# Altium schematic sheet microcontroller.SchDoc
size A4
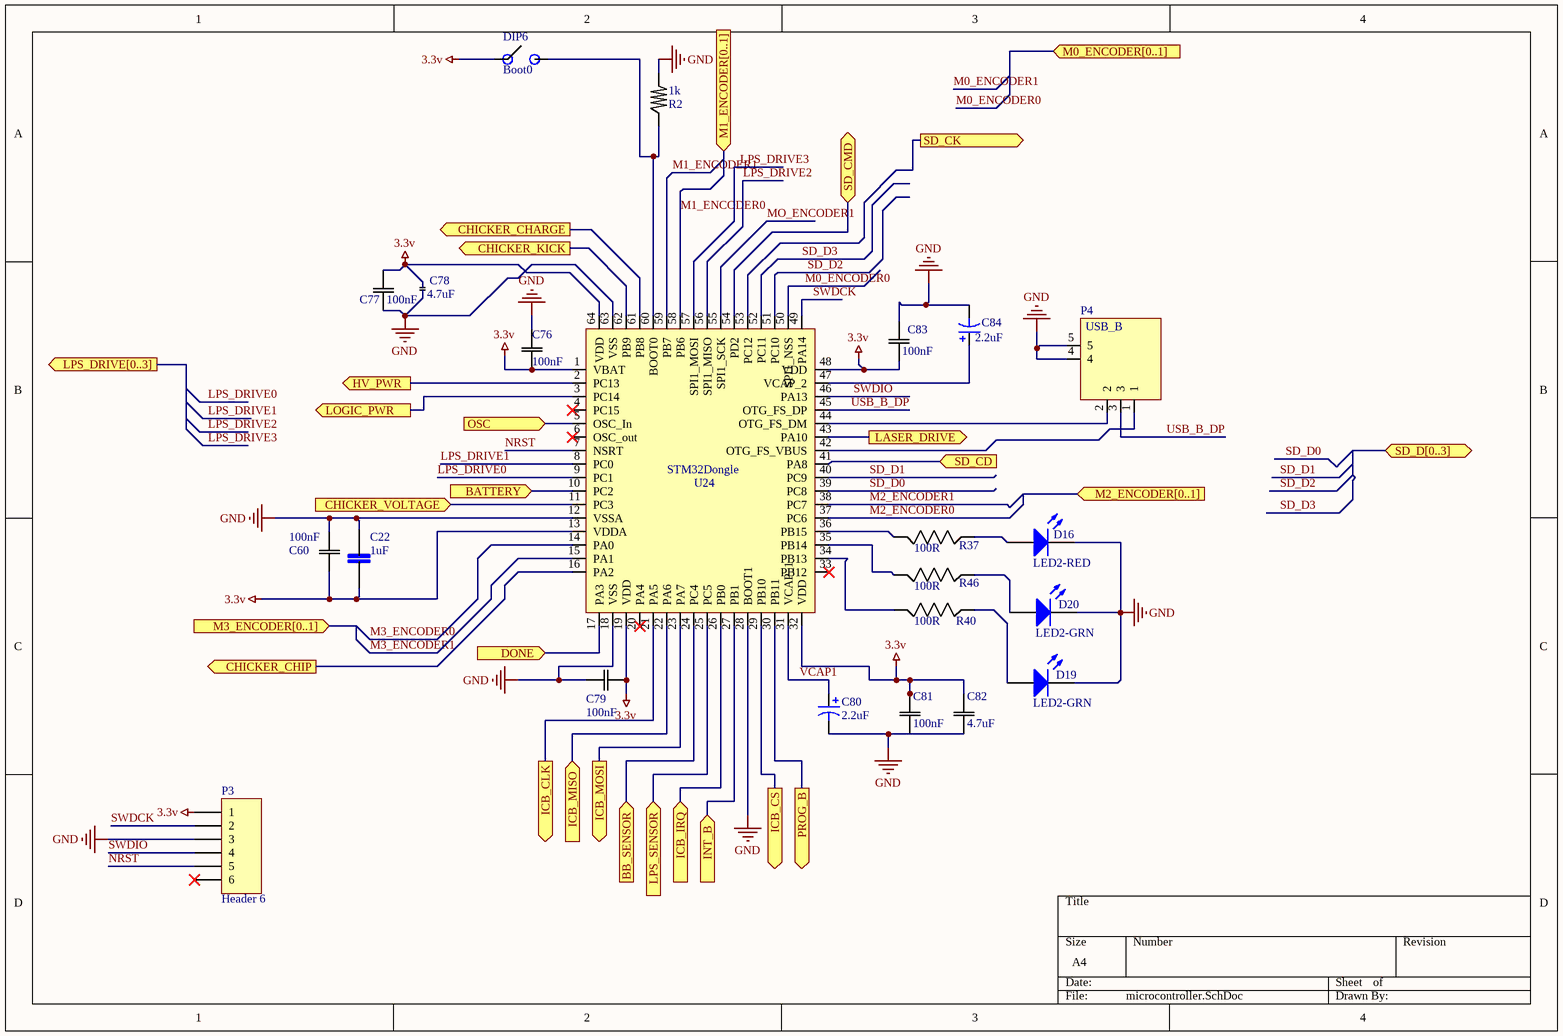
[diagram p0: microcontroller.SchDoc]

## Parts
1k  R2  [CAPC2012X140N]
C22  1uF  [INDC2012X87N]
C60  100nF  [CAPC2013X110N]
C76  100nF  [CAPC2013X110N]
C77  100nF  [CAPC2013X110N]
C78  4.7uF  [0805]
C79  100nF  [CAPC2013X110N]
C80  2.2uF  [C0805]
C81  100nF  [CAPC2013X110N]
C82  4.7uF  [CAPC2013X110N]
C83  100nF  [CAPC2013X110N]
C84  2.2uF  [C0805]
D16  LED2-RED  [3.2X1.6X1.1]
D19  LED2-GRN  [3.2X1.6X1.1]
D20  LED2-GRN  [3.2X1.6X1.1]
DIP6  Boot0  [SOJ254P980X912-12M]
P3  Header 6  [HDR1X6]
P4  USB_B  [PCBComponent_1]
R37  100R  [RESC2012X60]
R40  100R  [RESC2012X60]
R46  100R  [RESC2012X60]
STM32Dongle  U24  [QFP50P1200X1200X160-64N]

## Ports
BATTERY (in), BB_SENSOR (in), CHICKER_CHARGE (out), CHICKER_CHIP (out), CHICKER_KICK (out), CHICKER_VOLTAGE (in), DONE (in), HV_PWR (out), ICB_CLK (out), ICB_CS (out), ICB_IRQ (in), ICB_MISO (in), ICB_MOSI (out), INT_B (in), LASER_DRIVE (out), LOGIC_PWR (out), LPS_DRIVE[0..3] (out), LPS_SENSOR (in), M0_ENCODER[0..1] (in), M1_ENCODER[0..1] (in), M2_ENCODER[0..1] (in), M3_ENCODER[0..1] (in), OSC (in), PROG_B (out), SD_CD (in), SD_CK (out), SD_CMD (bidir), SD_D[0..3] (bidir)

## Nets
3.3v: C22.1 C60.1(C1) C76.1(C1) C77.2(C2) C78.P1 C79.2(C2) C81.2(C2) C82.2(C2) C83.1(C1) DIP6.12 P3.1 STM32Dongle.1(VBAT) STM32Dongle.13(VDDA) STM32Dongle.19(VDD) STM32Dongle.32(VDD) STM32Dongle.48(VDD) STM32Dongle.64(VDD)
GND: 1k.2 C22.2 C60.2(C2) C76.2(C2) C77.1(C1) C78.P2 C79.1(C1) C80.2 C81.1(C1) C82.1(C1) C83.2(C2) C84.2 D16.2(K) D19.2(K) D20.2(K) P3.3 P4.4 P4.5 STM32Dongle.12(VSSA) STM32Dongle.18(VSS) STM32Dongle.28(BOOT1) STM32Dongle.63(VSS)
BATTERY: STM32Dongle.10(PC2) ; port BATTERY
BB_SENSOR: STM32Dongle.24(PC4) ; port BB_SENSOR
CHICKER_CHARGE: STM32Dongle.61(PB8) ; port CHICKER_CHARGE
CHICKER_CHIP: STM32Dongle.16(PA2) ; port CHICKER_CHIP
CHICKER_KICK: STM32Dongle.62(PB9) ; port CHICKER_KICK
CHICKER_VOLTAGE: STM32Dongle.11(PC3) ; port CHICKER_VOLTAGE
DONE: STM32Dongle.17(PA3) ; port DONE
HV_PWR: STM32Dongle.2(PC13) ; port HV_PWR
ICB_CLK: STM32Dongle.21(PA5) ; port ICB_CLK
ICB_CS: STM32Dongle.29(PB10) ; port ICB_CS
ICB_IRQ: STM32Dongle.26(PB0) ; port ICB_IRQ
ICB_MISO: STM32Dongle.22(PA6) ; port ICB_MISO
ICB_MOSI: STM32Dongle.23(PA7) ; port ICB_MOSI
INT_B: STM32Dongle.27(PB1) ; port INT_B
LASER_DRIVE: STM32Dongle.43(PA10) ; port LASER_DRIVE
LOGIC_PWR: STM32Dongle.3(PC14) ; port LOGIC_PWR
LPS_DRIVE0: STM32Dongle.9(PC1)
LPS_DRIVE1: STM32Dongle.8(PC0)
LPS_DRIVE2: STM32Dongle.56(SPI1_MISO)
LPS_DRIVE3: STM32Dongle.57(SPI1_MOSI)
LPS_SENSOR: STM32Dongle.25(PC5) ; port LPS_SENSOR
M0_ENCODER0: STM32Dongle.50(SPI1_NSS)
M1_ENCODER0: STM32Dongle.58(PB6)
M1_ENCODER1: STM32Dongle.59(PB7)
M2_ENCODER0: STM32Dongle.37(PC6)
M2_ENCODER1: STM32Dongle.38(PC7)
M3_ENCODER0: STM32Dongle.14(PA0)
M3_ENCODER1: STM32Dongle.15(PA1)
MO_ENCODER1: STM32Dongle.55(SPI1_SCK)
NRST: P3.5 STM32Dongle.7(NSRT)
OSC: STM32Dongle.5(OSC_In) ; port OSC
PROG_B: STM32Dongle.30(PB11) ; port PROG_B
SD_CD: STM32Dongle.41(PA8) ; port SD_CD
SD_CK: STM32Dongle.53(PC12) ; port SD_CK
SD_CMD: STM32Dongle.54(PD2) ; port SD_CMD
SD_D0: STM32Dongle.39(PC8)
SD_D1: STM32Dongle.40(PC9)
SD_D2: STM32Dongle.51(PC10)
SD_D3: STM32Dongle.52(PC11)
SWDCK: P3.2 STM32Dongle.49(PA14)
SWDIO: P3.4 STM32Dongle.46(PA13)
USB_B_DP: P4.3 STM32Dongle.45(OTG_FS_DP)
VCAP1: C80.1 STM32Dongle.31(VCAP_1)
Net1k_1: 1k.1 DIP6.1 STM32Dongle.60(BOOT0)
NetC84_1: C84.1 STM32Dongle.47(VCAP_2)
NetD16_1: D16.1(A) R37.2
NetD19_1: D19.1(A) R40.2
NetD20_1: D20.1(A) R46.2
NetP4_1: P4.1 STM32Dongle.42(OTG_FS_VBUS)
NetP4_2: P4.2 STM32Dongle.44(OTG_FS_DM)
NetR37_1: R37.1 STM32Dongle.36(PB15)
NetR40_1: R40.1 STM32Dongle.34(PB13)
NetR46_1: R46.1 STM32Dongle.35(PB14)

Not connected (* = marked no-connect by the designer): P3 6*; STM32Dongle 4(PC15)* 6(OSC_out)* 20(PA4)* 33(PB12)*

## Library data of the parts
1k = 1kohm: 1276-5272-1-ND
C22 = C2012X5R1E105M085AC: CAP CER 1UF 25V X5R 0805; MF: TDK; Package: 0805 TDK; MP: C2012X5R1E105M085AC; Value: *
C60 C76 C77 = C0805C104K5RACTU: Capacitor; Ceramic; Cap; .100UF ; Tol+-10%; SMD; Vol-Rtg 50V; X7R, Tape/Reel; MF: Kemet; Package: 0805 Kemet; MP: C0805C104K5RACTU; Value: *
C79 C81 = C0805C104K5RACTU: Capacitor; Ceramic; Cap; .100UF ; Tol+-10%; SMD; Vol-Rtg 50V; X7R, Tape/Reel; Value: 0.1uF; MF: KEMET; DP: 399-1170-1-ND; Tolerance: 10%; MP: C0805C104K5RACTU; Distributor: Digikey; DL: https://www.digikey.ca/; Datasheet Link: https://content.kemet.com/datasheets/KEM_C1002_X7R_SMD.pdf; Part Number: 399-1170-1-ND; Package: 0805 (2012 Metric); Rating: 50V
C80 = Cap Pol3: CAP CER 2.2UF 25V X7R 0805; MF: Samsung Electro-Mechanics; MP: CL21B225KAFNNWE; DP: 1276-2955-1-ND; Tolerance: 10%; Distributor: Digikey; DL: https://www.digikey.ca/; Value: 2.2uF; Rating: 25V; Datasheet Link: http://www.samsungsem.com/kr/support/product-search/mlcc/__icsFiles/afieldfile/2018/07/24/CL21B225KAFNNWE.pdf; Package: 0805 (2012 Metric)
C82 = C0805C104K5RACTU: CAP CER 4.7UF 25V X5R 0805; MF: Samsung Electro-Mechanics; MP: CL21A475KAQNNNE; DP: 1276-1244-1-ND; Tolerance: 10%; Value: 4.7uF; Distributor: Digikey; DL: https://www.digikey.ca/; Datasheet Link: http://www.samsungsem.com/kr/support/product-search/mlcc/__icsFiles/afieldfile/2018/06/20/CL21A475KAQNNNE.pdf; Part Number: 1276-1244-1-ND; Package: 0805 (2012 Metric); Rating: 25V
C83 = C0805C104K5RACTU: 0.1µF ±10% 50V Ceramic Capacitor X7R 0805 (2012 Metric)l; MF: Kemet; Value: 0.1uF; DP: 399-1170-1-ND; Package: 0805 (2012 Metric); MP: C0805C104K5RACTU; Distributor: Digikey; Tolerance: 10%; Rating: 50V; DL: https://www.digikey.ca/product-detail/en/kemet/C0805C104K5RACTU/399-1170-1-ND/411445; Datasheet Link: https://content.kemet.com/datasheets/KEM_C1002_X7R_SMD.pdf; Dielectric: X7R
C84 = Cap Pol3: 2.2µF ±10% 25V Ceramic Capacitor X7R 0805 (2012 Metric); DP: 1276-2955-1-ND; MF: Samsung Electro-Mechanics; MP: CL21B225KAFNNWE; Value: 2.2uF; DL: www.digikey.ca; Rating: 25V; Tolerance: 10%; Package: 0805 (2012 Metric); Part Number: 1276-2955-1-ND; Datasheet Link: http://www.samsungsem.com/kr/support/product-search/mlcc/__icsFiles/afieldfile/2018/07/24/CL21B225KAFNNWE.pdf
D16 = LED2: LED GREEN CLEAR 1206 SMD; Part Number: 160-1167-1-ND; MF: Lite-On Inc.; MP: LTST-C150CKT; Distributor: Digikey; DP: 160-1167-1-ND; DL: https://www.digikey.ca/products/en?keywords=160-1167-1-ND; Datasheet Link: http://optoelectronics.liteon.com/upload/download/DS-22-98-0004/LTST-C150GKT.pdf; Package: 1206 (3216 Metric); Tolerance: N/A; Value: Green; Rating: N/A
D19 D20 = LED2: LED GREEN CLEAR 1206 SMD; Part Number: 160-1169-1-ND; MF: Lite-On Inc.; MP: LTST-C150GKT; Distributor: Digikey; DP: 160-1169-1-ND; DL: https://www.digikey.ca/products/en?keywords=160-1169-1-ND; Datasheet Link: http://optoelectronics.liteon.com/upload/download/DS-22-98-0004/LTST-C150GKT.pdf; Package: 1206 (3216 Metric); Tolerance: N/A; Value: Green; Rating: N/A
P3 = Header 6: Header, 6-Pin; LatestRevisionDate: 17-Jul-2002; LatestRevisionNote: Re-released for DXP Platform.; Publisher: Altium Limited
P4 = Component_1: DP: ED2980-ND; MF: On Shore Technology Inc.; MP: USB-B1KSW6; Rating: 1A; DL: https://www.digikey.ca/; Package: N/A; Part Number: ED2980-ND; Distributor: Digikey; Datasheet Link: http://www.on-shore.com/wp-content/uploads/2015/09/usb-b1ksxx.pdf; Value: USB_B; Tolerance: N/A
R37 R46 = RC0805FR-07100RL: RES SMD 100 OHM 1% 1/8W 0805; Part Number: 1276-5224-1-ND; MP: RC2012F101CS; MF: Samsung Electro-Mechanics; Package: 0805 (2012 Metric); Value: 100R; Distributor: Digikey; DP: 1276-5224-1-ND; Tolerance: 1%; Rating: 1/8W
  R46: DL: www.digikey.ca
R40 = RC0805FR-07100RL: RES SMD 100 OHM 1% 1/8W 0805; MP: RC2012F101CS; MF: Samsung Electro-Mechanics; DP: 1276-5224-1-ND; Package: 0805 (2012 Metric); Value: 100R; Tolerance: 1%; Rating: 1/8W; DL: https://www.digikey.ca/product-detail/en/samsung-electro-mechanics/RC2012F101CS/1276-5224-1-ND/3968196
STM32Dongle = STM32Dongle: 497-11907-ND; MF: STMicroelectronics; MP: STM32F415RGT6; Rating: 3.3V; DP: 497-11907-ND; Distributor: Digikey; Datasheet Link: https://www.st.com/content/ccc/resource/technical/document/datasheet/98/9f/89/73/01/b1/48/98/DM00035129.pdf/files/DM00035129.pdf/jcr:content/translations/en.DM00035129.pdf; DL: https://www.digikey.ca/; Package: 64-LQFP; Tolerance: N/A; Value: N/A